# Altium schematic sheet IMU.SchDoc
size A; SheetNumber: 2; SheetTotal: 6
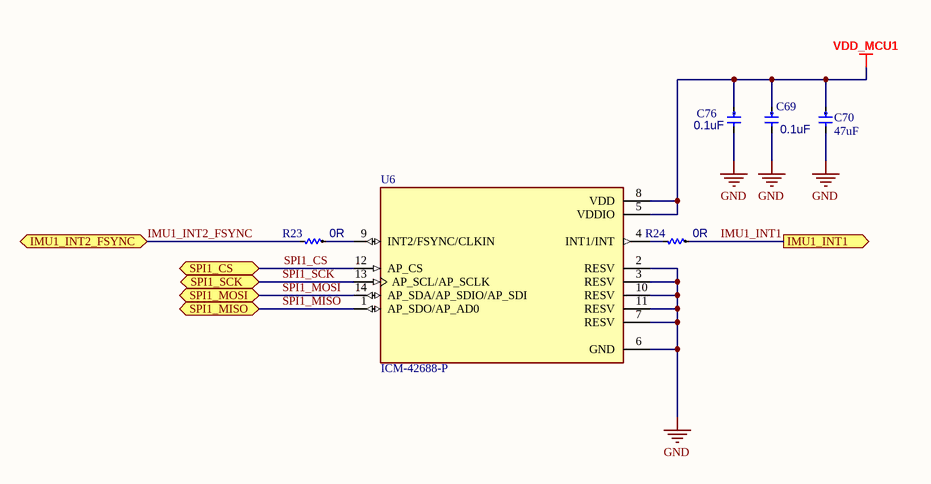
[diagram p0: IMU.SchDoc]

## Parts
C69  value 0.1uF  [CAP0402]  (hidden comment: CAP0402 0.1uF 50V)
C70  Capacitance: 47uF  [CAP0805]  (hidden comment: CL21A476MQYNNNE)
C76  value 0.1uF  [CAP0402]  (hidden comment: CAP0402 0.1uF 50V)
R23  value 0R  [RES0402]  (hidden comment: RES0402 0R)
R24  value 0R  [RES0402]  (hidden comment: RES0402 0R)
U6  ICM-42688-P  [IMU42688]

## Ports
IMU1_INT1 (out), IMU1_INT2_FSYNC (bidir), SPI1_CS (bidir), SPI1_MISO (bidir), SPI1_MOSI (bidir), SPI1_SCK (bidir)

## Nets
GND: C69.2 C70.2 C76.2 U6.2(RESV) U6.3(RESV) U6.6(GND) U6.7(RESV) U6.10(RESV) U6.11(RESV)
VDD_MCU1: C69.1 C70.1 C76.1 U6.5(VDDIO) U6.8(VDD)
IMU1_INT1: R24.2 ; port IMU1_INT1
IMU1_INT2_FSYNC: R23.1 ; port IMU1_INT2_FSYNC
SPI1_CS: U6.12(AP_CS) ; port SPI1_CS
SPI1_MISO: U6.1(AP_SDO/AP_AD0) ; port SPI1_MISO
SPI1_MOSI: U6.14(AP_SDA/AP_SDIO/AP_SDI) ; port SPI1_MOSI
SPI1_SCK: U6.13(AP_SCL/AP_SCLK) ; port SPI1_SCK
NetR23_2: R23.2 U6.9(INT2/FSYNC/CLKIN)
NetR24_1: R24.1 U6.4(INT1/INT)

## Library data of the parts
C69 C76 = CAP0402 0.1uF 50V: Cap 0.1uF 50V 0402; MP: CC0402KRX5R9BB104; Tolerance: 10%; Voltage: 50V; Package: 0402
C70 = 885012107014: CAP CER 47UF 6.3V X5R 0805; Tolerance: 20%; Manufacturer Part Number: CL21A476MQYNNNE; RoHS: Yes; Category: Ceramic Capacitors; Stock 1: 3580; Pricing 1: 1=0.37000, 5=0.35200, 10=0.33000, 25=0.31900, 50=0.30900, 100=0.29800 (USD); Mount: Surface Mount; Case/Package: 0805; Case Code (Metric): 2012; Case Code (Imperial): 0805; Min Operating Temperature: -55°C; Max Operating Temperature: 85°C; Packaging: Cut Tape; Voltage Rating: 6.3V; Dielectric: X5R; Voltage Rating (DC): 6.3V; Series: WCAP-CSGP; Length: 0.079inch; Width: 0.049inch; Thickness: 0.057inch; RoHS Compliant: Yes; ComponentLink1URL: http://www.farnell.com/datasheets/1958454.pdf?src-supplier=Farnell; ComponentLink1Description: http://www.farnell.com/datasheets/1958454.pdf?src-supplier=Farnell; ComponentLink2URL: http://www.farnell.com/datasheets/1958454.pdf?src-supplier=Element14; ComponentLink2Description: http://www.farnell.com/datasheets/1958454.pdf?src-supplier=Element14; ComponentLink3URL: https://katalog.we-online.de/pbs/datasheet/885012107014.pdf?src-supplier=Digi-Key; ComponentLink3Description: https://katalog.we-online.de/pbs/datasheet/885012107014.pdf?src-supplier=Digi-Key; ComponentLink4URL: http://www.farnell.com/datasheets/1958454.pdf?src-supplier=Newark; ComponentLink4Description: http://www.farnell.com/datasheets/1958454.pdf?src-supplier=Newark; Supplier 1: Newark
R23 R24 = RES0402 0R: RES 0R 0402; MP: RC0402JR-070RL; Power Rating: 63mW; Tolerance: 5%; Package: 0402
U6 = ICM-42688-P: Accelerometer, Gyroscope, 6 Axis Sensor Output; Package: None; MP: ICM-42688-P; Value: *; Availability: Unavailable; Price: None